# Altium schematic sheet [2]Controler.SchDoc
size A3; PageSetup: Record=PageOptions|CenterHorizontal=True|CenterVertical=True|PrintScale=0.73|XCorrection=1.00|YCorrection=1.00|PrintKind=1|BorderSize=5000000|LeftOffset=0|BottomOffset=0|Orientation=2|PaperLength=1000|PaperWidth=1000|Scale=100|PaperSource=7|PrintQuality=-3|MediaType=1|DitherType=10|PrintScaleMode=1|PaperKind=A4|PaperIndex=9
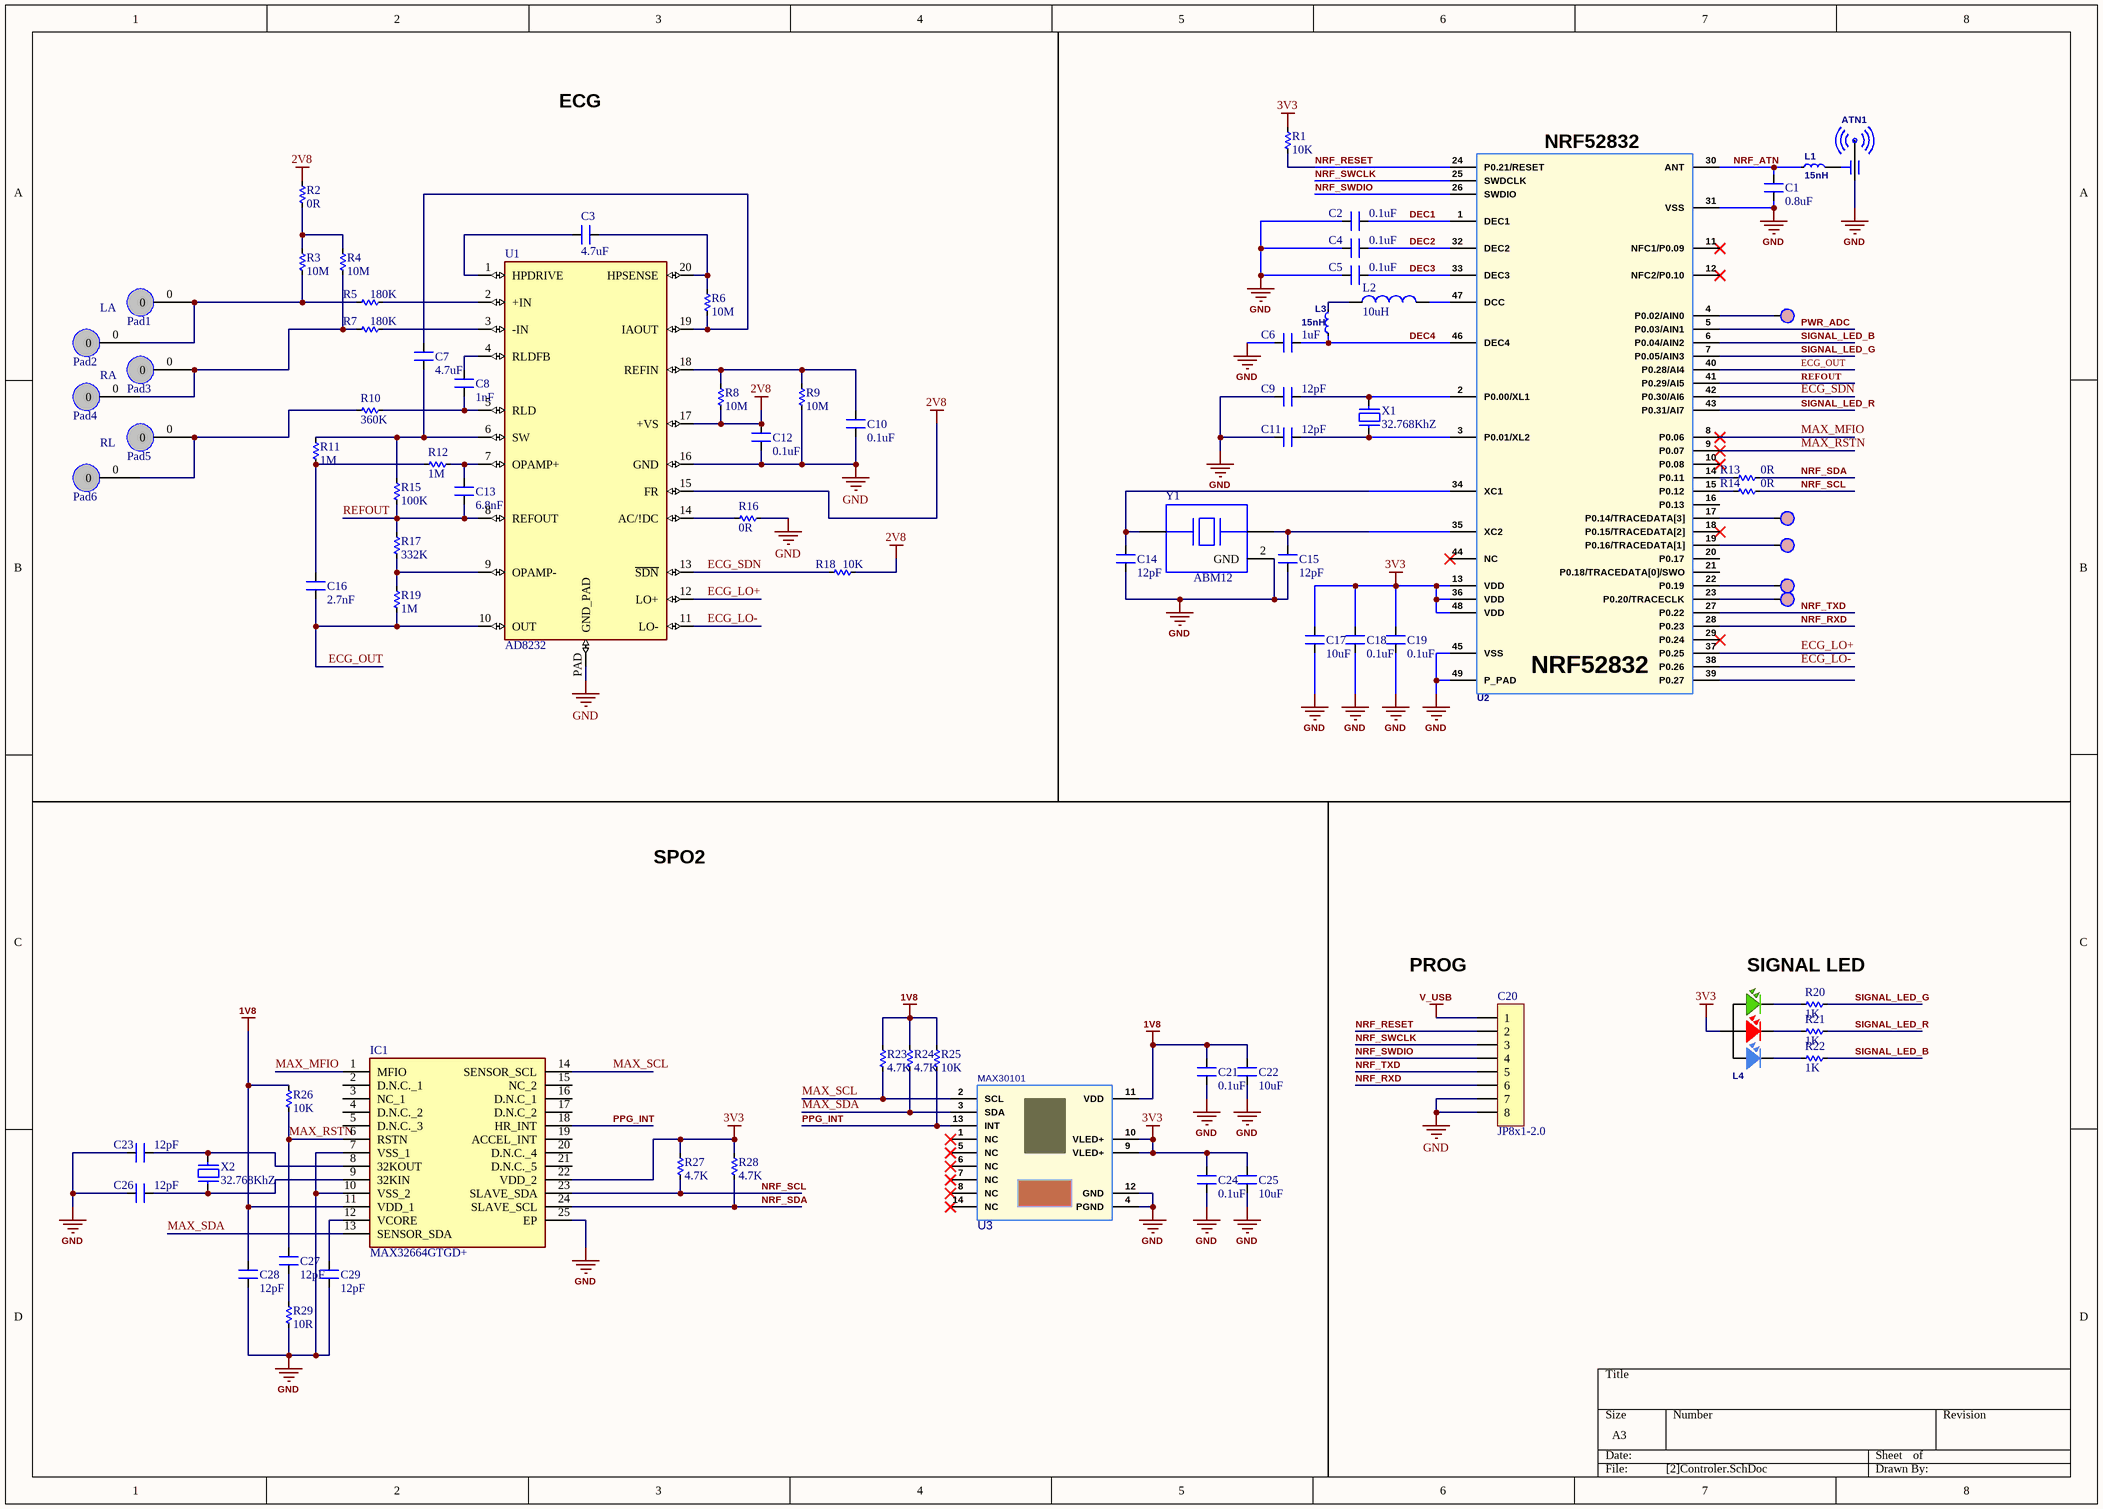
[diagram p0: [2]Controler.SchDoc]

## Parts
ATN1  P-ANT  [Antenna 2G4]  (value not drawn)
C1  0.8uF  [CN-SMD-0603]
C2  0.1uF  [CN-SMD-0603]
C3  4.7uF  [CN-SMD-0603]
C4  0.1uF  [CN-SMD-0603]
C5  0.1uF  [CN-SMD-0603]
C6  1uF  [CN-SMD-0603]
C7  4.7uF  [CN-SMD-0603]
C8  1nF  [CN-SMD-0603]
C9  12pF  [CN-SMD-0603]
C10  0.1uF  [CN-SMD-0603]
C11  12pF  [CN-SMD-0603]
C12  0.1uF  [CN-SMD-0603]
C13  6.8nF  [CN-SMD-0603]
C14  12pF  [CN-SMD-0603]
C15  12pF  [CN-SMD-0603]
C16  2.7nF  [CN-SMD-0603]
C17  10uF  [CN-SMD-0603]
C18  0.1uF  [CN-SMD-0603]
C19  0.1uF  [CN-SMD-0603]
C20  JP8x1-2.0  [J8-D1T]
C21  0.1uF  [CN-SMD-0603]
C22  10uF  [CN-SMD-0603]
C23  12pF  [CN-SMD-0603]
C24  0.1uF  [CN-SMD-0603]
C25  10uF  [CN-SMD-0603]
C26  12pF  [CN-SMD-0603]
C27  12pF  [CN-SMD-0603]
C28  12pF  [CN-SMD-0603]
C29  12pF  [CN-SMD-0603]
IC1  MAX32664GTGD+  [MAX32664GTGD]
L1  15nH  [P-INDC-0402INDC1005X60N EIA]
L2  10uH  [INDC1608X95N]
L3  15nH  [P-INDC-0402INDC1005X60N EIA]
L4  Led RGB 0603 Anot  [Led RGB 0603 Anode]  (value not drawn)
Pad1  LA  [pad_ecg]
Pad2  LA  [pad_ecg]  (value not drawn)
Pad3  RA  [pad_ecg]
Pad4  pad_ecg  [pad_ecg]  (value not drawn)
Pad5  RL  [pad_ecg]
Pad6  pad_ecg  [pad_ecg]  (value not drawn)
R1  10K  [RES-SMD-0603]
R2  0R  [RES-SMD-0603]
R3  10M  [RES-SMD-0603]
R4  10M  [RES-SMD-0603]
R5  180K  [RES-SMD-0603]
R6  10M  [RES-SMD-0603]
R7  180K  [RES-SMD-0603]
R8  10M  [RES-SMD-0603]
R9  10M  [RES-SMD-0603]
R10  360K  [RES-SMD-0603]
R11  1M  [RES-SMD-0603]
R12  1M  [RES-SMD-0603]
R13  0R  [RES-SMD-0603]
R14  0R  [RES-SMD-0603]
R15  100K  [RES-SMD-0603]
R16  0R  [RES-SMD-0603]
R17  332K  [RES-SMD-0603]
R18  10K  [RES-SMD-0603]
R19  1M  [RES-SMD-0603]
R20  1K  [RES-SMD-0603]
R21  1K  [RES-SMD-0603]
R22  1K  [RES-SMD-0603]
R23  4.7K  [RES-SMD-0603]
R24  4.7K  [RES-SMD-0603]
R25  10K  [RES-SMD-0603]
R26  10K  [RES-SMD-0603]
R27  4.7K  [RES-SMD-0603]
R28  4.7K  [RES-SMD-0603]
R29  10R  [RES-SMD-0603]
TP1  TP  [P-TP 1MM]  (value not drawn)  (no BOM)
TP2  TP  [P-TP 1MM]  (value not drawn)  (no BOM)
TP3  TP  [P-TP 1MM]  (value not drawn)  (no BOM)
TP4  TP  [P-TP 1MM]  (value not drawn)  (no BOM)
TP5  TP  [P-TP 1MM]  (value not drawn)  (no BOM)
U1  AD8232  [LFCSP_20]
U2  Nrf52832  [QFN48_NRF52832]  (value not drawn)
U3  MAX30101  [MAX30101]
X1  32.768KhZ  [XT2-32.768KHz-2_V]
X2  32.768KhZ  [XT2-32.768KHz-2_V]
Y1  ABM12  [DFN160X120X45-4N]

## Nets
1V8: C21.2 C22.2 C28.1 IC1.11(VDD_1) R23.2 R24.2 R25.2 R26.2 U3.11(VDD)
2V8: C12.2 R2.1 R8.2 R18.2 U1.15(FR) U1.17(+VS)
3V3: C17.1 C18.1 C19.1 C24.2 C25.2 IC1.22(VDD_2) L4.2 R1.2 R27.2 R28.2 U2.13(VDD) U2.36(VDD) U2.48(VDD) U3.9(VLED+) U3.10(VLED+)
GND: ATN1.1 C1.1 C2.1 C4.1 C5.1 C6.1 C9.2 C10.1 C11.2 C12.1 C14.1 C15.1 C17.2 C18.2 C19.2 C20.7 C20.8 C21.1 C22.1 C23.2 C24.1 C25.1 C26.2 C28.2 C29.2 IC1.7(VSS_1) IC1.10(VSS_2) IC1.25(EP) R9.2 R16.2 R29.1 U1.16(GND) U1.PAD(GND_PAD) U2.31(VSS) U2.45(VSS) U2.49(P_PAD) U3.4(PGND) U3.12(GND) Y1.2(GND)
V_USB: C20.1
DEC1: C2.2 U2.1(DEC1)
DEC2: C4.2 U2.32(DEC2)
DEC3: C5.2 U2.33(DEC3)
DEC4: C6.2 L3.1 U2.46(DEC4)
ECG_LO+: U1.12(LO+) U2.37(P0.25)
ECG_LO-: U1.11(LO-) U2.38(P0.26)
ECG_OUT: C16.2 R19.1 U1.10(OUT) U2.40(P0.28/AI4)
ECG_SDN: R18.1 U1.13(~{SDN}) U2.42(P0.30/AI6)
MAX_MFIO: IC1.1(MFIO) U2.8(P0.06)
MAX_RSTN: C27.1 IC1.6(RSTN) R26.1 U2.9(P0.07)
MAX_SCL: IC1.14(SENSOR_SCL) R23.1 U3.2(SCL)
MAX_SDA: IC1.13(SENSOR_SDA) R24.1 U3.3(SDA)
NRF_ATN: C1.2 L1.1 U2.30(ANT)
NRF_RESET: C20.2 R1.1 U2.24(P0.21/RESET)
NRF_RXD: C20.6 U2.28(P0.23)
NRF_SCL: IC1.23(SLAVE_SDA) R14.1 R27.1
NRF_SDA: IC1.24(SLAVE_SCL) R13.1 R28.1
NRF_SWCLK: C20.3 U2.25(SWDCLK)
NRF_SWDIO: C20.4 U2.26(SWDIO)
NRF_TXD: C20.5 U2.27(P0.22)
PPG_INT: IC1.18(HR_INT) R25.1 U3.13(INT)
PWR_ADC: U2.5(P0.03/AIN1)
REFOUT: C13.2 R15.1 R17.2 U1.8(REFOUT) U2.41(P0.29/AI5)
SIGNAL_LED_B: R22.2 U2.6(P0.04/AIN2)
SIGNAL_LED_G: R20.2 U2.7(P0.05/AIN3)
SIGNAL_LED_R: R21.2 U2.43(P0.31/AI7)
NetATN1_2: ATN1.2 L1.2
NetC3_1: C3.1 R6.1 U1.20(HPSENSE)
NetC3_2: C3.2 U1.1(HPDRIVE)
NetC7_1: C7.1 R6.2 U1.19(IAOUT)
NetC7_2: C7.2 R11.2 R15.2 U1.6(SW)
NetC8_1: C8.1 U1.4(RLDFB)
NetC8_2: C8.2 R10.2 U1.5(RLD)
NetC9_1: C9.1 U2.2(P0.00/XL1) X1.2
NetC10_2: C10.2 R8.1 R9.1 U1.18(REFIN)
NetC11_1: C11.1 U2.3(P0.01/XL2) X1.1
NetC13_1: C13.1 R12.2 U1.7(OPAMP+)
NetC14_2: C14.2 U2.34(XC1) Y1.1
NetC15_2: C15.2 U2.35(XC2) Y1.3
NetC16_1: C16.1 R11.1 R12.1
NetC23_1: C23.1 IC1.8(32KOUT) X2.2
NetC26_1: C26.1 IC1.9(32KIN) X2.1
NetC27_2: C27.2 R29.2
NetC29_1: C29.1 IC1.12(VCORE)
NetL2_1: L2.1 L3.2
NetL2_2: L2.2 U2.47(DCC)
NetL4_1: L4.1 R21.1
NetL4_3: L4.3 R22.1
NetL4_4: L4.4 R20.1
NetPad1_0: Pad1.0 Pad2.0 R3.2 R5.1
NetPad3_0: Pad3.0 Pad4.0 R4.2 R7.1
NetPad5_0: Pad5.0 Pad6.0 R10.1
NetR2_2: R2.2 R3.1 R4.1
NetR5_2: R5.2 U1.2(+IN)
NetR7_2: R7.2 U1.3(-IN)
NetR13_2: R13.2 U2.14(P0.11)
NetR14_2: R14.2 U2.15(P0.12)
NetR16_1: R16.1 U1.14(AC/!DC)
NetR17_1: R17.1 R19.2 U1.9(OPAMP-)
NetTP1_1: TP1.1 U2.4(P0.02/AIN0)
NetTP2_1: TP2.1 U2.17(P0.14/TRACEDATA[3])
NetTP3_1: TP3.1 U2.19(P0.16/TRACEDATA[1])
NetTP4_1: TP4.1 U2.22(P0.19)
NetTP5_1: TP5.1 U2.23(P0.20/TRACECLK)

Not connected (* = marked no-connect by the designer): IC1 2(D.N.C._1) 3(NC_1) 4(D.N.C._2) 5(D.N.C._3) 15(NC_2) 16(D.N.C_1) 17(D.N.C_2) 19(ACCEL_INT) 20(D.N.C._4) 21(D.N.C._5); U2 10(P0.08)* 11(NFC1/P0.09)* 12(NFC2/P0.10)* 16(P0.13) 18(P0.15/TRACEDATA[2])* 20(P0.17) 21(P0.18/TRACEDATA[0]/SWO) 29(P0.24)* 39(P0.27) 44(NC)*; U3 1(NC)* 5(NC)* 6(NC)* 7(NC)* 8(NC)* 14(NC)*

## Notes on the sheet
- ECG
- (near U2) NRF52832
- SPO2
- PROG
- SIGNAL LED
- (in symbol Nrf52832) NRF52832

## Library data of the parts
C1-C19 C21-C29 = CN: Tu gom; Value: 33pF
C20 = JP8x1-2.0: WR-PHD 2.00 mm Socket Header; Manufacturer: W¨¹rth Elektronik eiSos GmbH; partNo: 62000811821; ComponentLink1 Description: Manufacturer; ComponentLink2 Description: Datasheet; NoPins: 08; Created Date: 2 April 2013; ComponentLink1URL: http://www.we-online.com; ComponentLink2URL: http://katalog.we-online.de/em/datasheet/6200xx11821.pdf; Created by: Karrer Zheng
IC1 = MAX32664GTGD+: Integrated Circuit; Manufacturer_Name: Maxim Integrated; Datasheet Link: https://datasheets.maximintegrated.com/en/ds/MAX32664.pdf; Height: 0.8mm; Manufacturer_Part_Number: MAX32664GTGD+; Mouser Part Number: 700-MAX32664GTGD+; Mouser Price/Stock: https://www.mouser.co.uk/ProductDetail/Maxim-Integrated/MAX32664GTGD%2b?qs=vmHwEFxEFR8eXdzd1CMxwQ%3D%3D
L1 L3 = P-INDC-0603
L2 = ASMCI-0603-100N-T: Ind Chip Shielded Multi-Layer 10uH 30% 1MHz Ferrite 50mA 0603 T/R; Package: None; Price: None; Value: *; MP: ASMCI-0603-100N-T; Availability: Unavailable
Pad1-Pad3 Pad5 = pad_ecg
R1-R29 = Res-SMD: Resistor; Manufacturer: Generic Components; Class: Passive; Published: 08/06/2000; Publisher: Altium Hobart Technology Centre
TP1-TP5 = P-TESTPOINT
U1 = AD8232: ECG Front End 20-LFCSP-WQ _4x4_; MF: Analog Devices; Package: LFCSP-20 Analog Devices; MP: AD8232; Availability: Unavailable; Price: None; Value: *; SnapEDA_Link: https://www.snapeda.com/parts/AD8232/Analog%20Devices/view-part/4218063/?ref=snap
U2 = Nrf52832: BLE SoC
U3 = MAX30101: Pulse oximeter and Heart rate sensor
X1 X2 = XT2: Crystal, 32.768 KHz, -40 to 85 degC, 3.2 x 1.5 x 0.9 mm SMD; Value: 4Mhz
Y1 = ABM12-32.000MHZ-B2X-T3: Package: None; Price: None; Value: *; MP: ABM12-32.000MHZ-B2X-T3; Availability: Unavailable